# Altium project MoonPilot_Power.PrjPcb
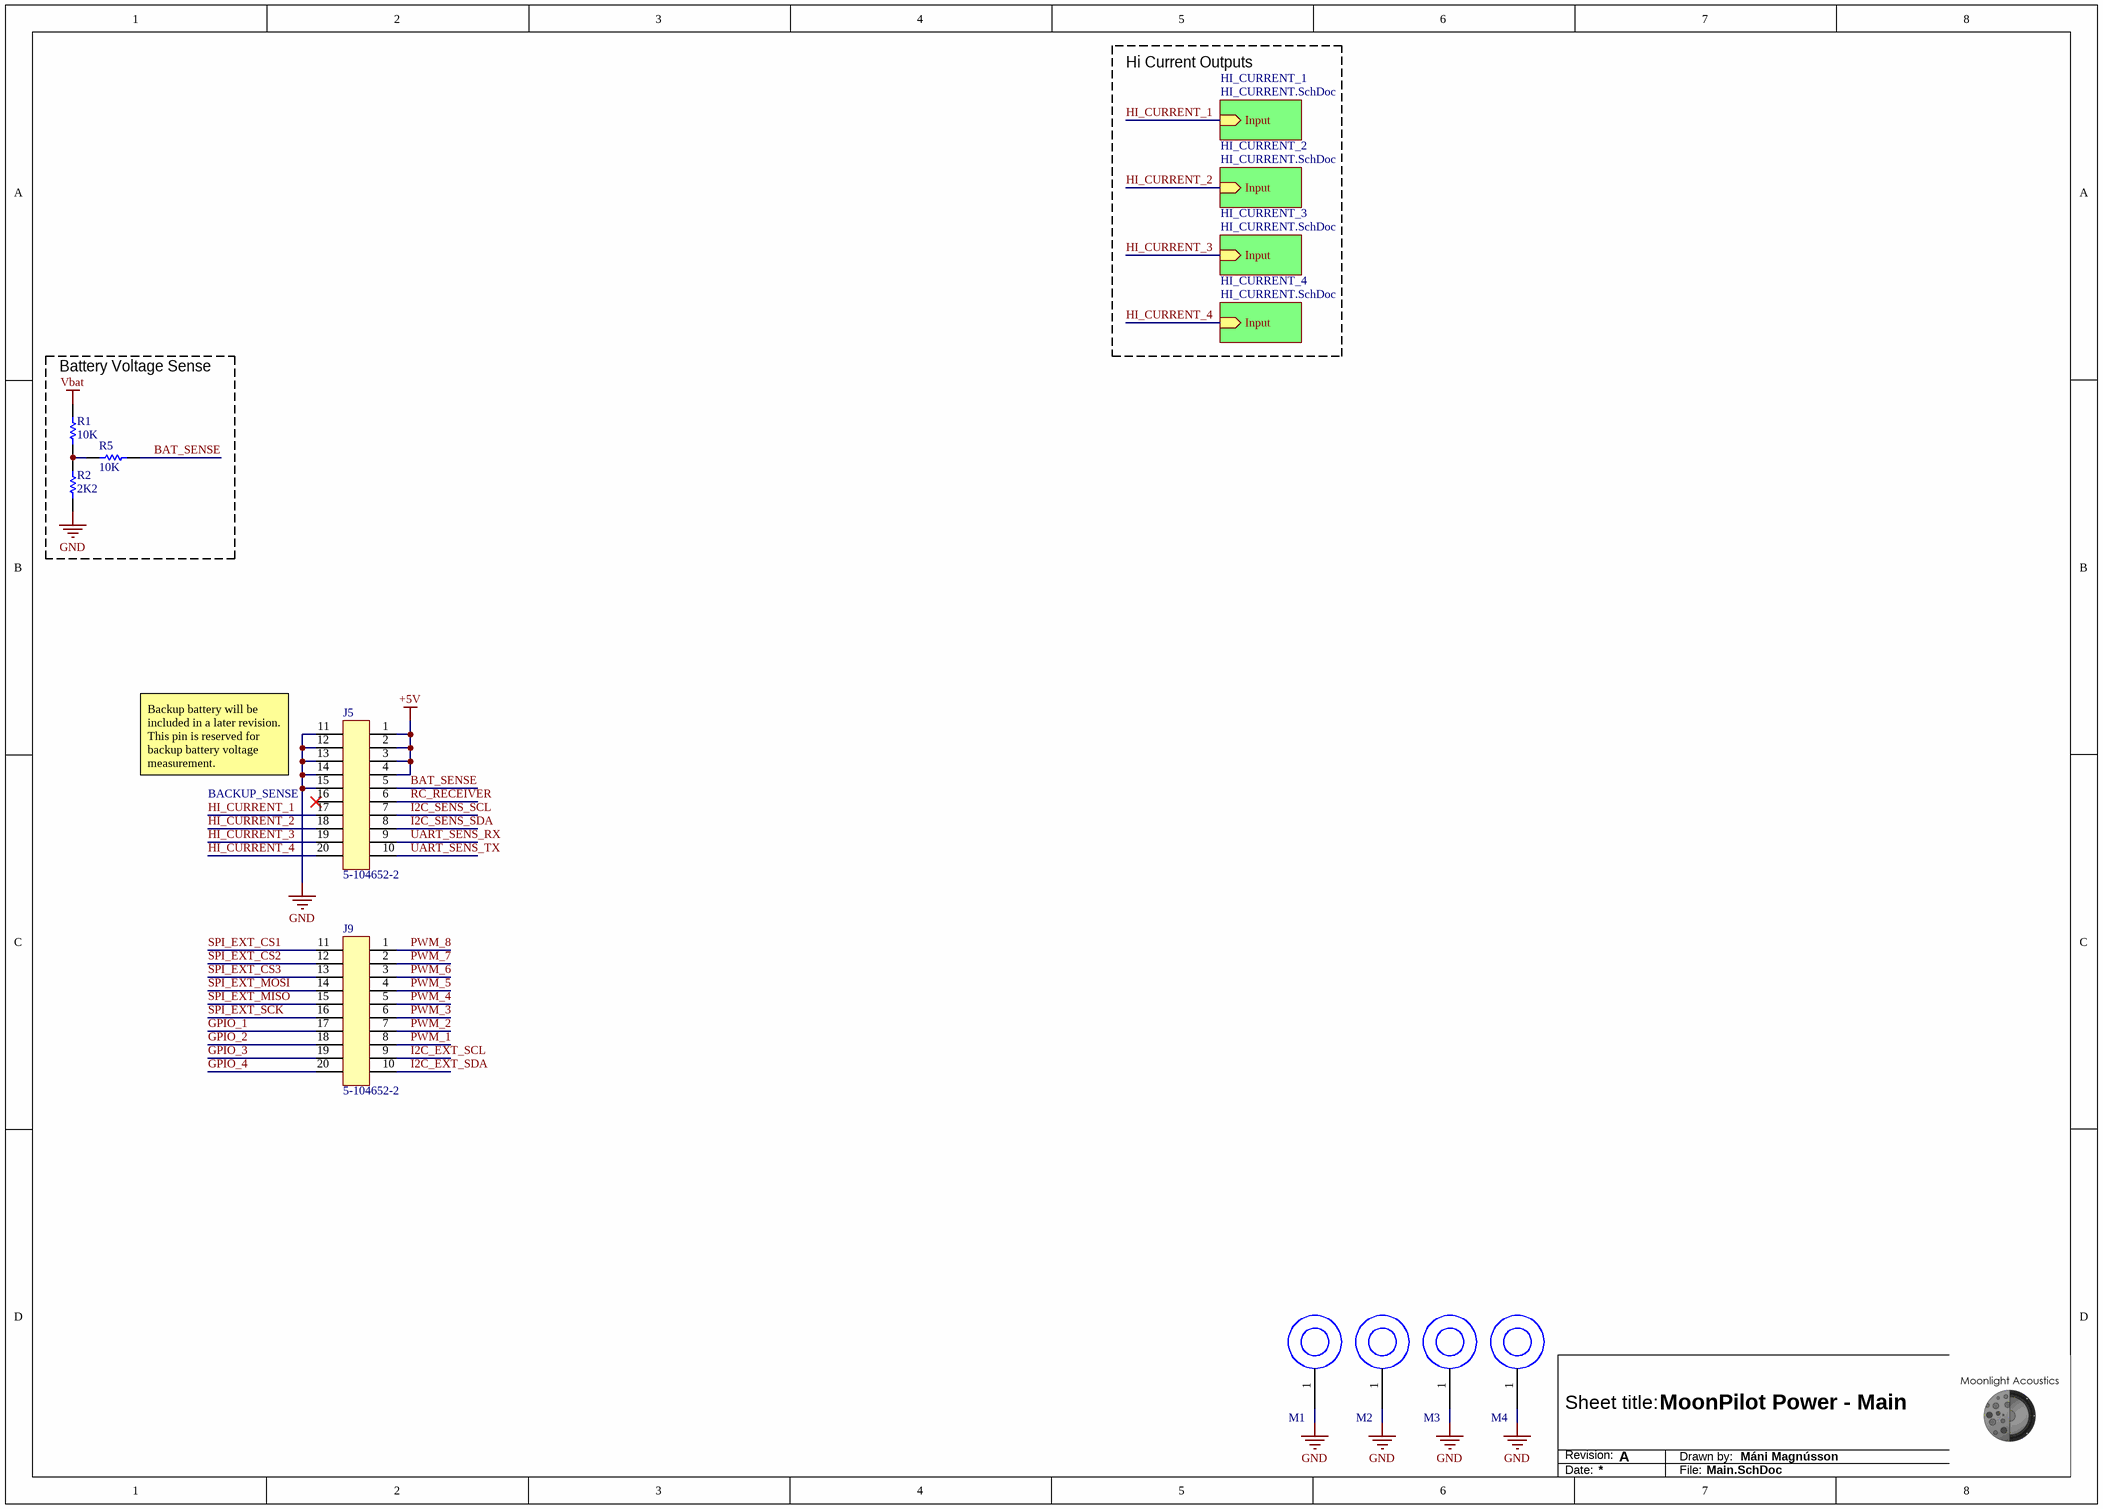
[diagram p0: Main.SchDoc]
2 sheets, 25 parts. Net scope: hierarchical (ports join the sheet entries above them; power ports are global).
Board file: MoonPilot_Power.PcbDoc
Sheets:
  Main.SchDoc
    HI_CURRENT_1 = Hi_Current.SchDoc
    HI_CURRENT_2 = Hi_Current.SchDoc
    HI_CURRENT_3 = Hi_Current.SchDoc
    HI_CURRENT_4 = Hi_Current.SchDoc

## Sheet Main.SchDoc: MoonPilot Power - Main
size A3; DrawnBy: Máni Magnússon; Revision: A

### Parts
J5  5-104652-2  [5-104652-2]
J9  5-104652-2  [5-104652-2]
M1  Mounting Screw  [M3_SCREW]  (value not drawn)
M2  Mounting Screw  [M3_SCREW]  (value not drawn)
M3  Mounting Screw  [M3_SCREW]  (value not drawn)
M4  Mounting Screw  [M3_SCREW]  (value not drawn)
R1  10K  [0805_RES]
R2  2K2  [0805_RES]
R5  10K  [0603_RES]

### Blocks framed on the sheet
Battery Voltage Sense: R1 R2 R5

### Sub-sheets
HI_CURRENT_1 = HI_CURRENT.SchDoc: Input (in)
HI_CURRENT_2 = HI_CURRENT.SchDoc: Input (in)
HI_CURRENT_3 = HI_CURRENT.SchDoc: Input (in)
HI_CURRENT_4 = HI_CURRENT.SchDoc: Input (in)

### Nets
+5V: J5.1 J5.2 J5.3 J5.4
GND: J5.11 J5.12 J5.13 J5.14 J5.15 M1.1 M2.1 M3.1 M4.1 R2.2
Vbat: R1.1
BAT_SENSE: J5.5 R5.2
GPIO_1: J9.17
GPIO_2: J9.18
GPIO_3: J9.19
GPIO_4: J9.20
HI_CURRENT_1: J5.17 ; sheet HI_CURRENT_1/Input
HI_CURRENT_2: J5.18 ; sheet HI_CURRENT_2/Input
HI_CURRENT_3: J5.19 ; sheet HI_CURRENT_3/Input
HI_CURRENT_4: J5.20 ; sheet HI_CURRENT_4/Input
I2C_EXT_SCL: J9.9
I2C_EXT_SDA: J9.10
I2C_SENS_SCL: J5.7
I2C_SENS_SDA: J5.8
PWM_1: J9.8
PWM_2: J9.7
PWM_3: J9.6
PWM_4: J9.5
PWM_5: J9.4
PWM_6: J9.3
PWM_7: J9.2
PWM_8: J9.1
RC_RECEIVER: J5.6
SPI_EXT_CS1: J9.11
SPI_EXT_CS2: J9.12
SPI_EXT_CS3: J9.13
SPI_EXT_MISO: J9.15
SPI_EXT_MOSI: J9.14
SPI_EXT_SCK: J9.16
UART_SENS_RX: J5.9
UART_SENS_TX: J5.10
NetR1_2: R1.2 R2.1 R5.1

Not connected (* = marked no-connect by the designer): J5 16(*)*

### Notes on the sheet
- Hi Current Outputs
- Backup battery will be included in a later revision. This pin is reserved for backup battery voltage measurement.
- BACKUP_SENSE
- Sheet title:
- Revision:
- Drawn by:
- Date:
- File:

### Library data of the parts
J5 J9 = 20 pin vertical board to board female: Digikey part no. A33547-ND / 1.27mm female board to board connector, 2 row
M1-M4 = Mounting Screw: M4 and M3 scew holes, just pick the right footprint
R1 R2 R5 = Resistor

## Sheet Hi_Current.SchDoc: MoonPilot Pwr - Hi Current
size A3; DrawnBy: Máni Magnússon; Revision: A
Used 4 times, as channels HI_CURRENT_1, HI_CURRENT_2, HI_CURRENT_3, HI_CURRENT_4. Parts and nets are listed once, with the designators drawn on the sheet.
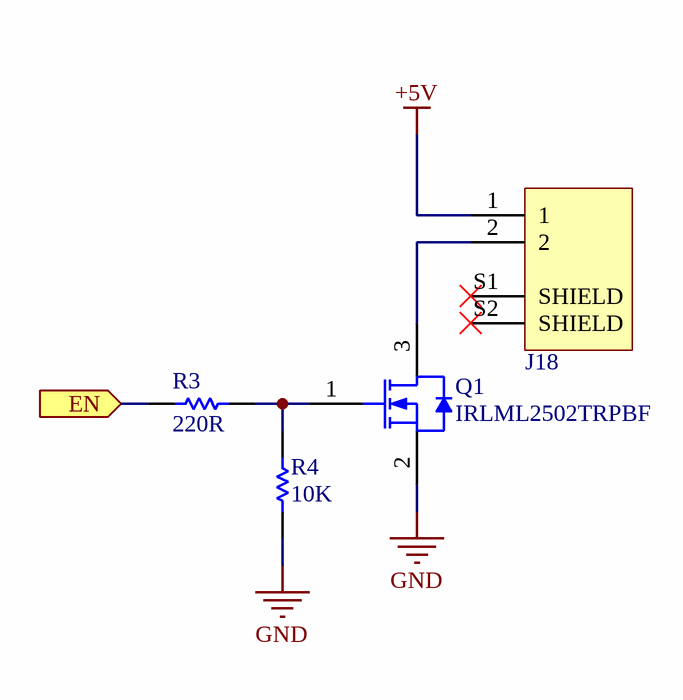
[diagram p1: Hi_Current.SchDoc]

### Parts
J18  2 pin vertical JST GH  [JST_BM02B-GHS-TBT(LF)(SN)(N)]  (value not drawn)
Q1  IRLML2502TRPBF  [INTR-SOT-23-3_V]
R3  220R  [0603_RES]
R4  10K  [0603_RES]

### Ports
EN (in)

### Nets
+5V: J18.1
GND: Q1.2(S) R4.2
EN: R3.1 ; port EN
NetJ18_2: J18.2 Q1.3(D)
NetQ1_1: Q1.1(G) R3.2 R4.1

Not connected (* = marked no-connect by the designer): J18 S1(SHIELD)* S2(SHIELD)*

### Channels
HI_CURRENT_1: designators end in _HI_CURRENT_1; ports EN=NetR3_HI_CURRENT_1_1
HI_CURRENT_2: designators end in _HI_CURRENT_2; ports EN=NetR3_HI_CURRENT_2_1
HI_CURRENT_3: designators end in _HI_CURRENT_3; ports EN=NetR3_HI_CURRENT_3_1
HI_CURRENT_4: designators end in _HI_CURRENT_4; ports EN=NetR3_HI_CURRENT_4_1

### Notes on the sheet
- Sheet title:
- Revision:
- Drawn by:
- Date:
- File:

### Library data of the parts
J18 = BM02B-GHS-TBT(LF)(SN)(N): JST GH vertical 2 pin / DigiKey part no. 455-1578-1-ND; MF: JST Sales; MP: BM04B-GHS-TBT_LF__SN__N_; SnapEDA_Link: https://www.snapeda.com/parts/BM04B-GHS-TBT%28LF%29%28SN%29%28N%29/JST%20Sales%20America%20Inc./view-part/841999/?ref=snap; Digi-Key_Part_Number: 455-1580-1-ND; Digi-Key_Purchase_URL: https://www.digikey.com/product-detail/en/jst-sales-america-inc/BM04B-GHS-TBT_LF__SN__N_/455-1580-1-ND/807848?utm_source=snapeda&utm_medium=aggregator&utm_campaign=symbol; Value: *; Package: None
Q1 = IRLML2502TRPBF: N-Channel HEXFET(R) Power MOSFET, 20 V VDS, +/- 12 V VGS, 4.2 A, 3-Pin SOT23, RoHS, Tape and Reel; Manufacturer: International Rectifier; Drain-to-Source Voltage [Vdss]: 20V; Drain-Source On Resistance-Max: 0.045O; Qg Gate Charge: 8nC; Rated Power Dissipation: 1.25W; Package Reference: SOT-23-3; Manufacturer URL: http://internationalrectifier.com/; Package Description: 3-Pin Small Outline Transistor, Body 2.92 x 1.3 mm, Pitch 0.95 mm; Datasheet Version: Apr-14; Channel Type: N-Channel; Datasheet URL: https://datasheet.ciiva.com/6383/irlml2502pbf-6383216.pdf
R3 R4 = Resistor

## Nets that join several sheets
+5V: Main (J5.1 J5.2 J5.3 J5.4), HI_CURRENT_1 (J18_HI_CURRENT_1.1), HI_CURRENT_2 (J18_HI_CURRENT_2.1), HI_CURRENT_3 (J18_HI_CURRENT_3.1), HI_CURRENT_4 (J18_HI_CURRENT_4.1)
GND: Main (10 pins), HI_CURRENT_1 (Q1_HI_CURRENT_1.2 R4_HI_CURRENT_1.2), HI_CURRENT_2 (Q1_HI_CURRENT_2.2 R4_HI_CURRENT_2.2), HI_CURRENT_3 (Q1_HI_CURRENT_3.2 R4_HI_CURRENT_3.2), HI_CURRENT_4 (Q1_HI_CURRENT_4.2 R4_HI_CURRENT_4.2)